# Altium schematic sheet LEDS1.SchDoc: LEDBO - LRTBR98G (LEDS 1)
size B; Author: Sébastien Gélinas; Organization: SmartHalo; Address1: 5445 de Gaspé; Address2: Montréal, QC; Address3: Canada; Address4: H2T 3B2; Revision: 1; SheetNumber: 3; SheetTotal: 5
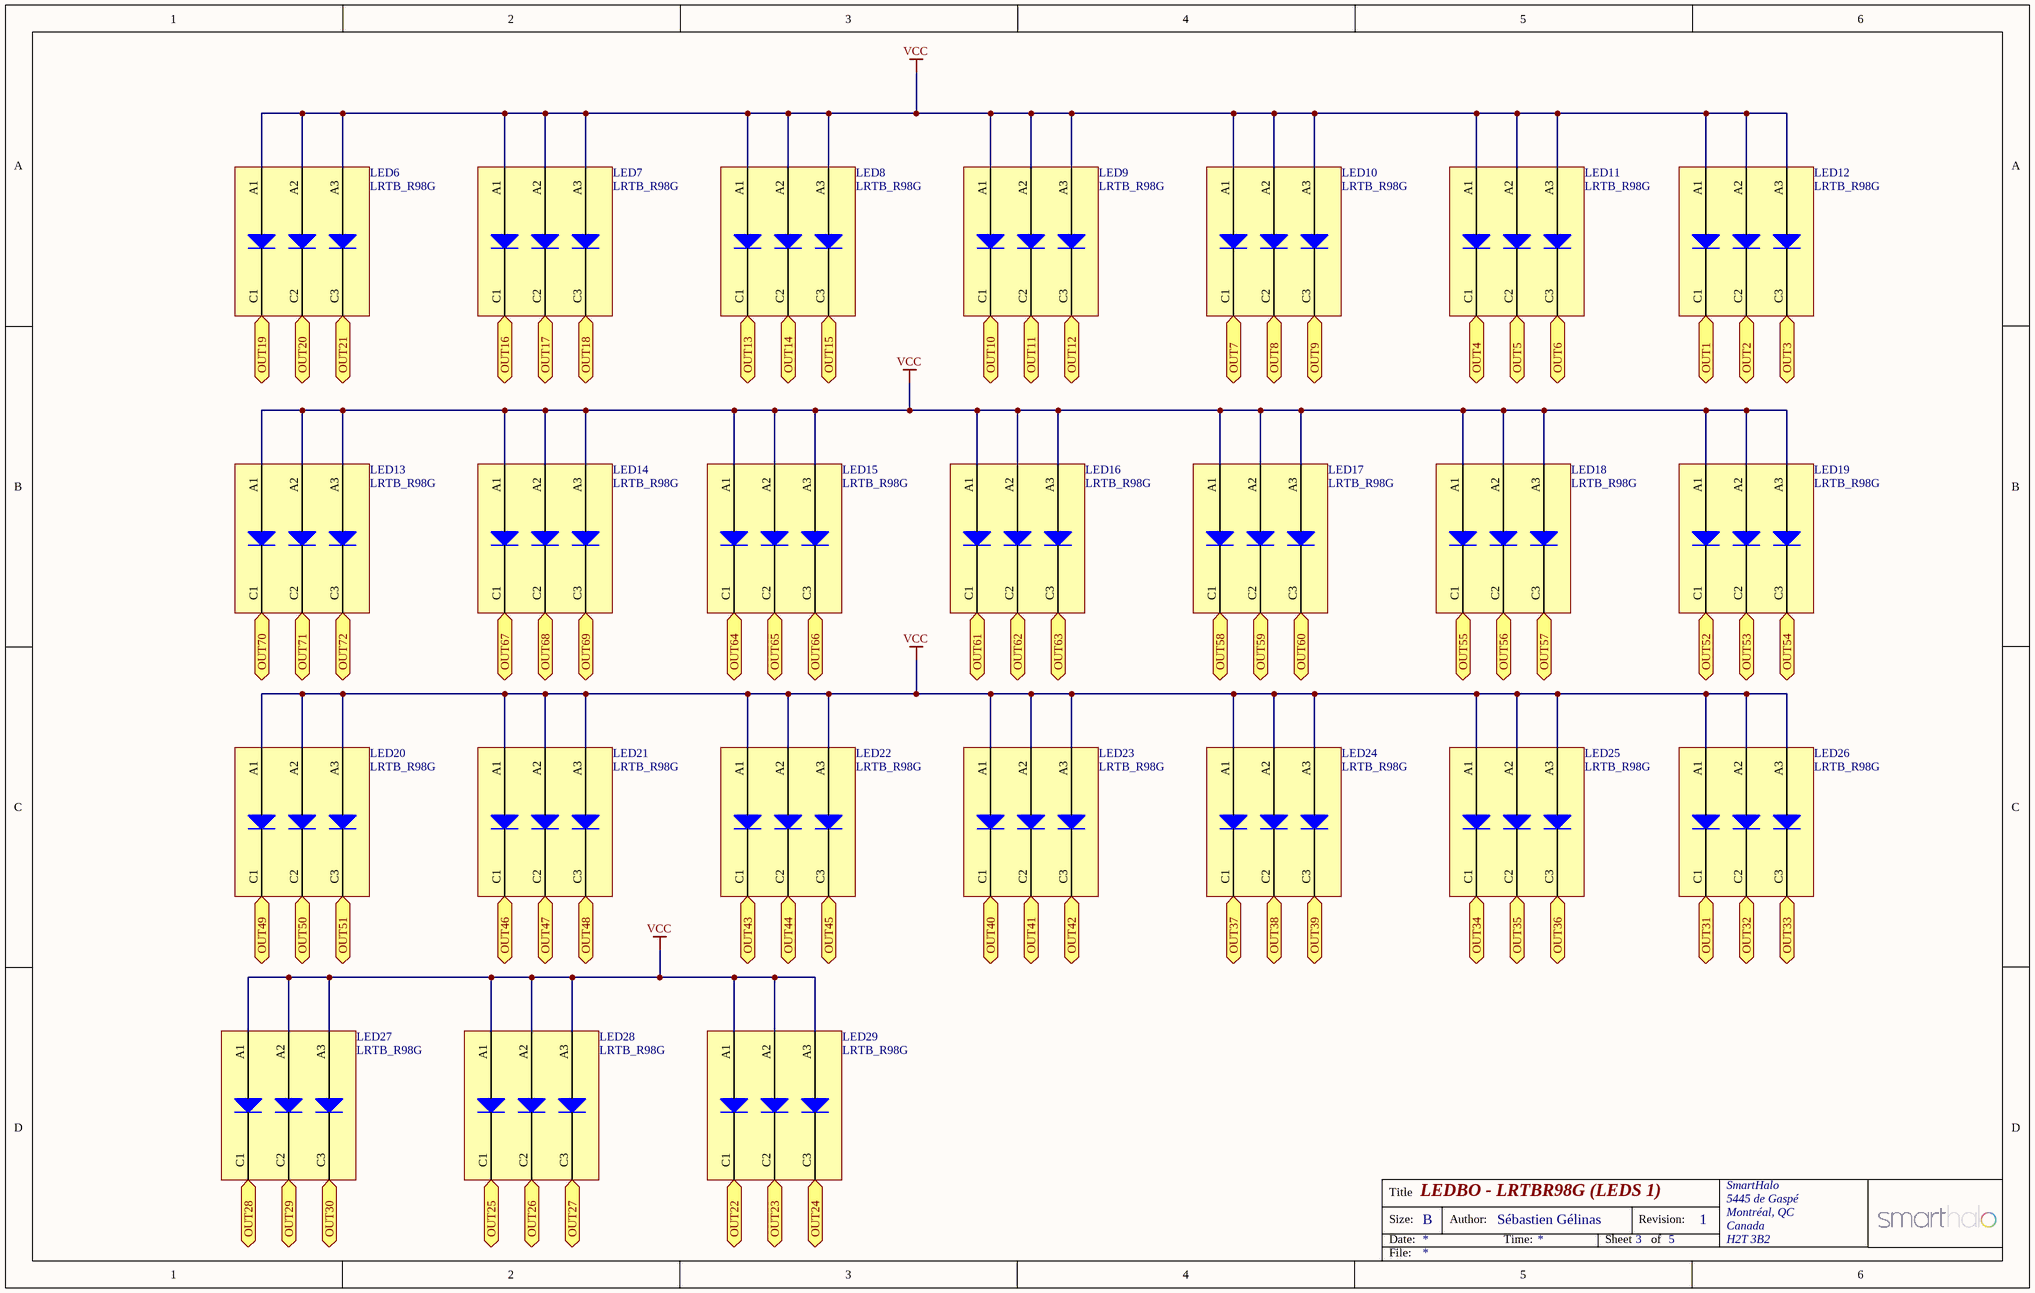
[diagram p0: LEDS1.SchDoc]

## Parts
LED6  LRTB_R98G  [LRTB_R98G]
LED7  LRTB_R98G  [LRTB_R98G]
LED8  LRTB_R98G  [LRTB_R98G]
LED9  LRTB_R98G  [LRTB_R98G]
LED10  LRTB_R98G  [LRTB_R98G]
LED11  LRTB_R98G  [LRTB_R98G]
LED12  LRTB_R98G  [LRTB_R98G]
LED13  LRTB_R98G  [LRTB_R98G]
LED14  LRTB_R98G  [LRTB_R98G]
LED15  LRTB_R98G  [LRTB_R98G]
LED16  LRTB_R98G  [LRTB_R98G]
LED17  LRTB_R98G  [LRTB_R98G]
LED18  LRTB_R98G  [LRTB_R98G]
LED19  LRTB_R98G  [LRTB_R98G]
LED20  LRTB_R98G  [LRTB_R98G]
LED21  LRTB_R98G  [LRTB_R98G]
LED22  LRTB_R98G  [LRTB_R98G]
LED23  LRTB_R98G  [LRTB_R98G]
LED24  LRTB_R98G  [LRTB_R98G]
LED25  LRTB_R98G  [LRTB_R98G]
LED26  LRTB_R98G  [LRTB_R98G]
LED27  LRTB_R98G  [LRTB_R98G]
LED28  LRTB_R98G  [LRTB_R98G]
LED29  LRTB_R98G  [LRTB_R98G]

## Ports
OUT1, OUT2, OUT3, OUT4, OUT5, OUT6, OUT7, OUT8, OUT9, OUT10, OUT11, OUT12, OUT13, OUT14, OUT15, OUT16, OUT17, OUT18, OUT19, OUT20, OUT21, OUT22, OUT23, OUT24, OUT25, OUT26, OUT27, OUT28, OUT29, OUT30, OUT31, OUT32, OUT33, OUT34, OUT35, OUT36, OUT37, OUT38, OUT39, OUT40, OUT41, OUT42, OUT43, OUT44, OUT45, OUT46, OUT47, OUT48, OUT49, OUT50, OUT51, OUT52, OUT53, OUT54, OUT55, OUT56, OUT57, OUT58, OUT59, OUT60, OUT61, OUT62, OUT63, OUT64, OUT65, OUT66, OUT67, OUT68, OUT69, OUT70, OUT71, OUT72

## Nets
VCC: LED6.A1(Anode_Blue) LED6.A2(Anode_Green) LED6.A3(Anode_Red) LED7.A1(Anode_Blue) LED7.A2(Anode_Green) LED7.A3(Anode_Red) LED8.A1(Anode_Blue) LED8.A2(Anode_Green) LED8.A3(Anode_Red) LED9.A1(Anode_Blue) LED9.A2(Anode_Green) LED9.A3(Anode_Red) LED10.A1(Anode_Blue) LED10.A2(Anode_Green) LED10.A3(Anode_Red) LED11.A1(Anode_Blue) LED11.A2(Anode_Green) LED11.A3(Anode_Red) LED12.A1(Anode_Blue) LED12.A2(Anode_Green) LED12.A3(Anode_Red) LED13.A1(Anode_Blue) LED13.A2(Anode_Green) LED13.A3(Anode_Red) LED14.A1(Anode_Blue) LED14.A2(Anode_Green) LED14.A3(Anode_Red) LED15.A1(Anode_Blue) LED15.A2(Anode_Green) LED15.A3(Anode_Red) LED16.A1(Anode_Blue) LED16.A2(Anode_Green) LED16.A3(Anode_Red) LED17.A1(Anode_Blue) LED17.A2(Anode_Green) LED17.A3(Anode_Red) LED18.A1(Anode_Blue) LED18.A2(Anode_Green) LED18.A3(Anode_Red) LED19.A1(Anode_Blue) LED19.A2(Anode_Green) LED19.A3(Anode_Red) LED20.A1(Anode_Blue) LED20.A2(Anode_Green) LED20.A3(Anode_Red) LED21.A1(Anode_Blue) LED21.A2(Anode_Green) LED21.A3(Anode_Red) LED22.A1(Anode_Blue) LED22.A2(Anode_Green) LED22.A3(Anode_Red) LED23.A1(Anode_Blue) LED23.A2(Anode_Green) LED23.A3(Anode_Red) LED24.A1(Anode_Blue) LED24.A2(Anode_Green) LED24.A3(Anode_Red) LED25.A1(Anode_Blue) LED25.A2(Anode_Green) LED25.A3(Anode_Red) LED26.A1(Anode_Blue) LED26.A2(Anode_Green) LED26.A3(Anode_Red) LED27.A1(Anode_Blue) LED27.A2(Anode_Green) LED27.A3(Anode_Red) LED28.A1(Anode_Blue) LED28.A2(Anode_Green) LED28.A3(Anode_Red) LED29.A1(Anode_Blue) LED29.A2(Anode_Green) LED29.A3(Anode_Red)
OUT1: LED12.C1(Cathode_Blue) ; port OUT1
OUT2: LED12.C2(Cathode_Green) ; port OUT2
OUT3: LED12.C3(Cathode_Red) ; port OUT3
OUT4: LED11.C1(Cathode_Blue) ; port OUT4
OUT5: LED11.C2(Cathode_Green) ; port OUT5
OUT6: LED11.C3(Cathode_Red) ; port OUT6
OUT7: LED10.C1(Cathode_Blue) ; port OUT7
OUT8: LED10.C2(Cathode_Green) ; port OUT8
OUT9: LED10.C3(Cathode_Red) ; port OUT9
OUT10: LED9.C1(Cathode_Blue) ; port OUT10
OUT11: LED9.C2(Cathode_Green) ; port OUT11
OUT12: LED9.C3(Cathode_Red) ; port OUT12
OUT13: LED8.C1(Cathode_Blue) ; port OUT13
OUT14: LED8.C2(Cathode_Green) ; port OUT14
OUT15: LED8.C3(Cathode_Red) ; port OUT15
OUT16: LED7.C1(Cathode_Blue) ; port OUT16
OUT17: LED7.C2(Cathode_Green) ; port OUT17
OUT18: LED7.C3(Cathode_Red) ; port OUT18
OUT19: LED6.C1(Cathode_Blue) ; port OUT19
OUT20: LED6.C2(Cathode_Green) ; port OUT20
OUT21: LED6.C3(Cathode_Red) ; port OUT21
OUT22: LED29.C1(Cathode_Blue) ; port OUT22
OUT23: LED29.C2(Cathode_Green) ; port OUT23
OUT24: LED29.C3(Cathode_Red) ; port OUT24
OUT25: LED28.C1(Cathode_Blue) ; port OUT25
OUT26: LED28.C2(Cathode_Green) ; port OUT26
OUT27: LED28.C3(Cathode_Red) ; port OUT27
OUT28: LED27.C1(Cathode_Blue) ; port OUT28
OUT29: LED27.C2(Cathode_Green) ; port OUT29
OUT30: LED27.C3(Cathode_Red) ; port OUT30
OUT31: LED26.C1(Cathode_Blue) ; port OUT31
OUT32: LED26.C2(Cathode_Green) ; port OUT32
OUT33: LED26.C3(Cathode_Red) ; port OUT33
OUT34: LED25.C1(Cathode_Blue) ; port OUT34
OUT35: LED25.C2(Cathode_Green) ; port OUT35
OUT36: LED25.C3(Cathode_Red) ; port OUT36
OUT37: LED24.C1(Cathode_Blue) ; port OUT37
OUT38: LED24.C2(Cathode_Green) ; port OUT38
OUT39: LED24.C3(Cathode_Red) ; port OUT39
OUT40: LED23.C1(Cathode_Blue) ; port OUT40
OUT41: LED23.C2(Cathode_Green) ; port OUT41
OUT42: LED23.C3(Cathode_Red) ; port OUT42
OUT43: LED22.C1(Cathode_Blue) ; port OUT43
OUT44: LED22.C2(Cathode_Green) ; port OUT44
OUT45: LED22.C3(Cathode_Red) ; port OUT45
OUT46: LED21.C1(Cathode_Blue) ; port OUT46
OUT47: LED21.C2(Cathode_Green) ; port OUT47
OUT48: LED21.C3(Cathode_Red) ; port OUT48
OUT49: LED20.C1(Cathode_Blue) ; port OUT49
OUT50: LED20.C2(Cathode_Green) ; port OUT50
OUT51: LED20.C3(Cathode_Red) ; port OUT51
OUT52: LED19.C1(Cathode_Blue) ; port OUT52
OUT53: LED19.C2(Cathode_Green) ; port OUT53
OUT54: LED19.C3(Cathode_Red) ; port OUT54
OUT55: LED18.C1(Cathode_Blue) ; port OUT55
OUT56: LED18.C2(Cathode_Green) ; port OUT56
OUT57: LED18.C3(Cathode_Red) ; port OUT57
OUT58: LED17.C1(Cathode_Blue) ; port OUT58
OUT59: LED17.C2(Cathode_Green) ; port OUT59
OUT60: LED17.C3(Cathode_Red) ; port OUT60
OUT61: LED16.C1(Cathode_Blue) ; port OUT61
OUT62: LED16.C2(Cathode_Green) ; port OUT62
OUT63: LED16.C3(Cathode_Red) ; port OUT63
OUT64: LED15.C1(Cathode_Blue) ; port OUT64
OUT65: LED15.C2(Cathode_Green) ; port OUT65
OUT66: LED15.C3(Cathode_Red) ; port OUT66
OUT67: LED14.C1(Cathode_Blue) ; port OUT67
OUT68: LED14.C2(Cathode_Green) ; port OUT68
OUT69: LED14.C3(Cathode_Red) ; port OUT69
OUT70: LED13.C1(Cathode_Blue) ; port OUT70
OUT71: LED13.C2(Cathode_Green) ; port OUT71
OUT72: LED13.C3(Cathode_Red) ; port OUT72

## Notes on the sheet
- Title
- Size:
- Date:
- B
- Author:
- Time:
- Sheet
- Revision:
- of
- File:

## Library data of the parts
LED6-LED29 = LRTB_R98G: IC RGB LED OSRAM; Manufacturer: OSRAM